# EAGLE schematic PIR (EAGLE 6.4)
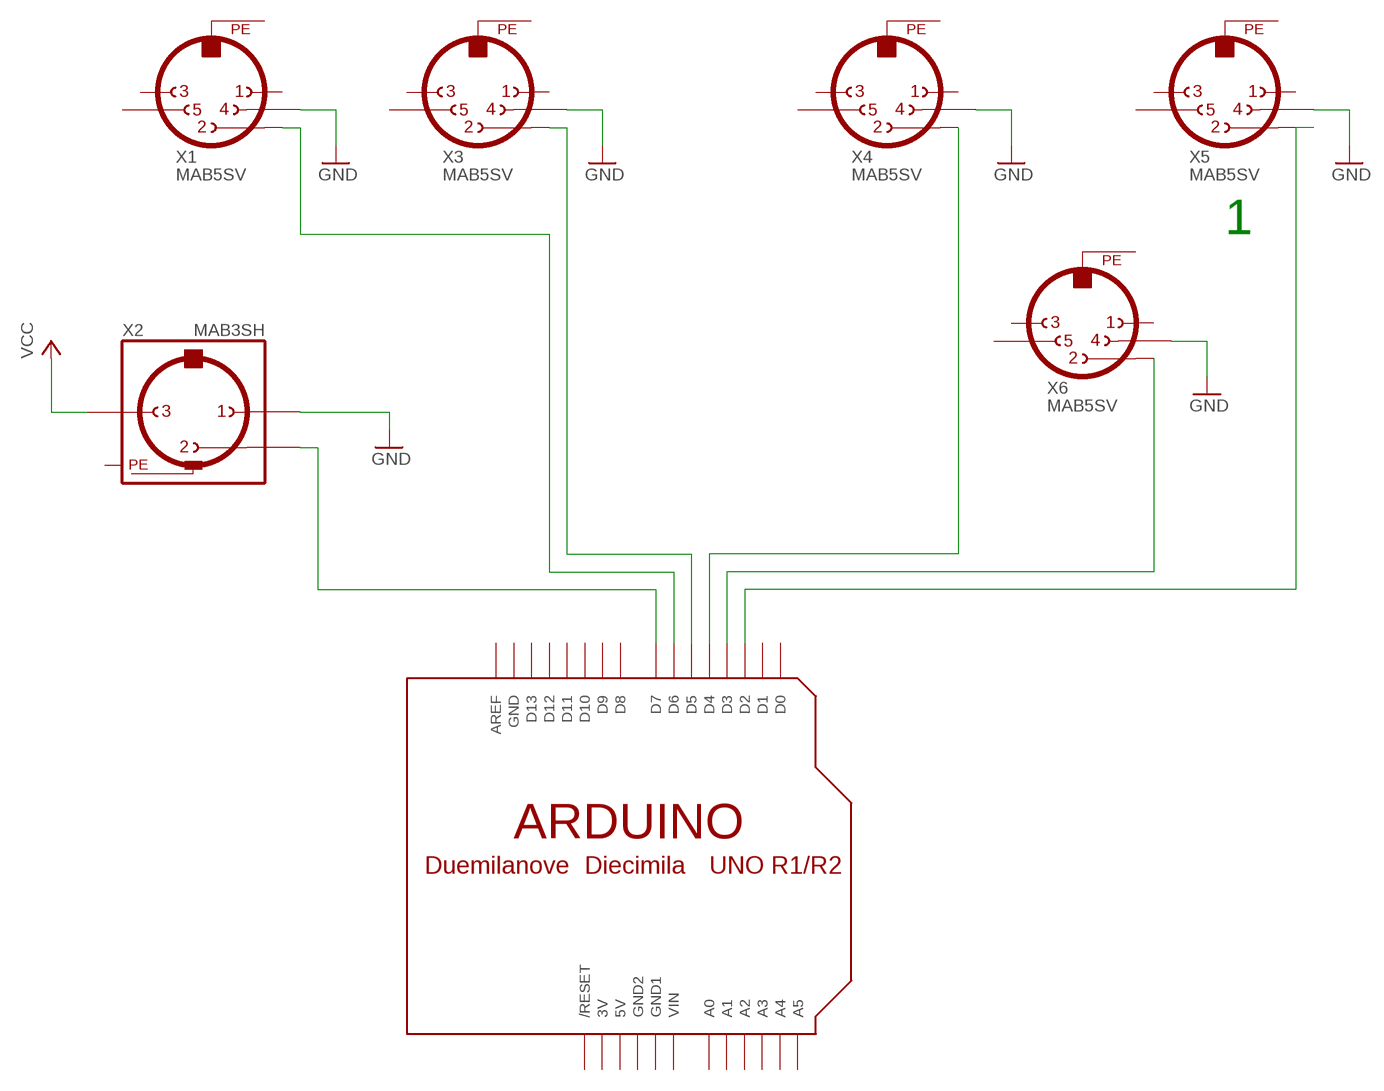
[diagram p0: schematic, sheet 1]

## Parts
U$1  ARDUINO-BPLACE  [ARDUINO-BPLACE]
X1  MAB5SV  [MAB5SV]
X2  MAB3SH  [MAB3SH]
X3  MAB5SV  [MAB5SV]
X4  MAB5SV  [MAB5SV]
X5  MAB5SV  [MAB5SV]
X6  MAB5SV  [MAB5SV]

## Nets
GND: X1.4 X2.1 X3.4 X4.4 X5.4 X6.4
N$1: U$1.D2 X5.2
N$2: U$1.D7 X2.2
N$3: U$1.D3 X6.2
N$4: U$1.D4 X4.2
N$5: U$1.D5 X3.2
N$6: U$1.D6 X1.2
VCC: X2.3
Unconnected: U$1.A0 U$1.A1 U$1.A2 U$1.A3 U$1.A4 U$1.A5 U$1.AREF U$1.D0 U$1.D1 U$1.D8 U$1.D9 U$1.D10 U$1.D11 U$1.D12 U$1.D13 U$1.RESET(/RESET) X1.1 X1.3 X1.5 X3.1 X3.3 X3.5 X4.1 X4.3 X4.5 X5.1 X5.3 X5.5 X6.1 X6.3 X6.5

## Notes on the sheet
- 1

## Power pins joined to a net without a drawn wire
3V: U$1.3V
5V: U$1.5V
GND: U$1.GND
GND1: U$1.GND1
GND2: U$1.GND2
PE: X1.PE X2.PE X2.PE@(PE) X3.PE X4.PE X5.PE X6.PE
VIN: U$1.VIN

## Library data of the parts
U$1 = adafruit:ARDUINO: Arduino Diecimila/Duemilanove Make a shield with ease, this package has all the named pins as well as the two mounting drill holes and an outline of the USB and DC power connector. The outline is on the DIMENSION layer, so if your board house uses it they will cut the outline to match. http://www.ladyada.net/library/pcb/eaglelibrary.html
X1 X3-X6 = con-hirschmann:MAB5SV: Female CONNECTOR 5 pins 90 deg. with shield, vertical (DIN41524); OC_FARNELL: unknown; OC_NEWARK: unknown
X2 = con-hirschmann:MAB3SH: Female CONNECTOR 3 pins with shield, horizontal (DIN 41524); OC_FARNELL: 809871; OC_NEWARK: unknown